# EAGLE design buffered-mult-pcb-a (EAGLE 7.2.0)
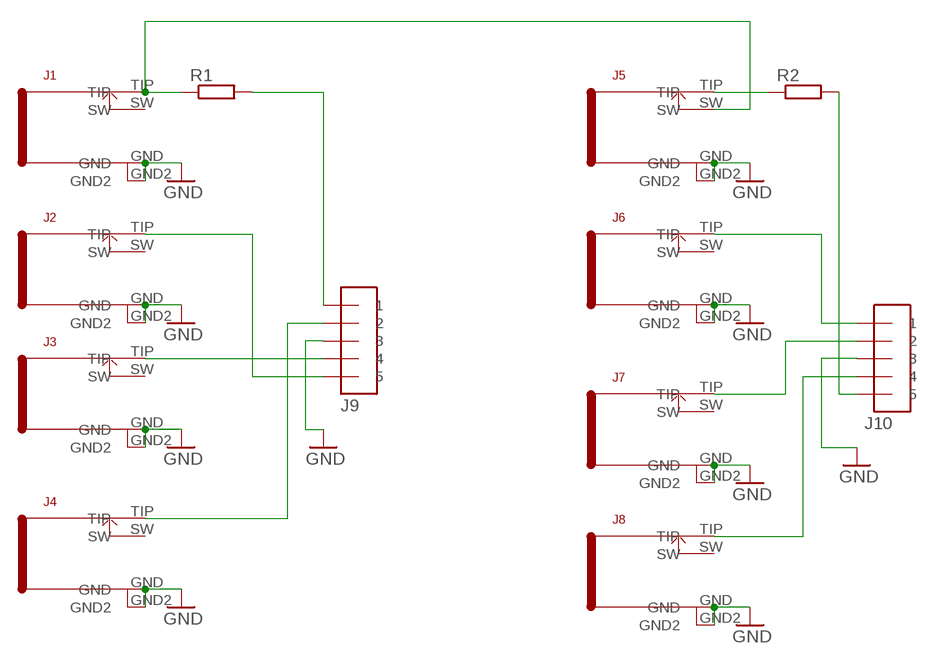
[diagram p0: schematic, sheet 1]

## Parts
J1  WQP_PJ_301BM  [WQP_PJ_301BM]
J2  WQP_PJ_301BM  [WQP_PJ_301BM]
J3  WQP_PJ_301BM  [WQP_PJ_301BM]
J4  WQP_PJ_301BM  [WQP_PJ_301BM]
J5  WQP_PJ_301BM  [WQP_PJ_301BM]
J6  WQP_PJ_301BM  [WQP_PJ_301BM]
J7  WQP_PJ_301BM  [WQP_PJ_301BM]
J8  WQP_PJ_301BM  [WQP_PJ_301BM]
J9  5X1_2_54_HEADER  [5X1_2_54_HEADER]
J10  5X1_2_54_HEADER  [5X1_2_54_HEADER]
R1  R-EU_R0603  [R0603]
R2  R-EU_R0603  [R0603]

## Nets
GND: J1.GND J1.GND2 J2.GND J2.GND2 J3.GND J3.GND2 J4.GND J4.GND2 J5.GND J5.GND2 J6.GND J6.GND2 J7.GND J7.GND2 J8.GND J8.GND2 J9.3 J10.3
N$1: J2.TIP J9.5
N$2: J3.TIP J9.4
N$3: J4.TIP J9.2
N$4: J10.5 R2.2
N$5: J7.TIP J10.2
N$6: J8.TIP J10.4
N$7: J6.TIP J10.1
N$9: J1.TIP J5.SW R1.1
N$10: J9.1 R1.2
N$11: J5.TIP R2.1
Unconnected: J1.SW J2.SW J3.SW J4.SW J6.SW J7.SW J8.SW

## Library data of the parts
J1-J8 = mjb-parts:WQP_PJ_301BM
J9 J10 = mjb-parts:5X1_2_54_HEADER
R1 R2 = rcl:R-EU_: RESISTOR, European symbol

## Board
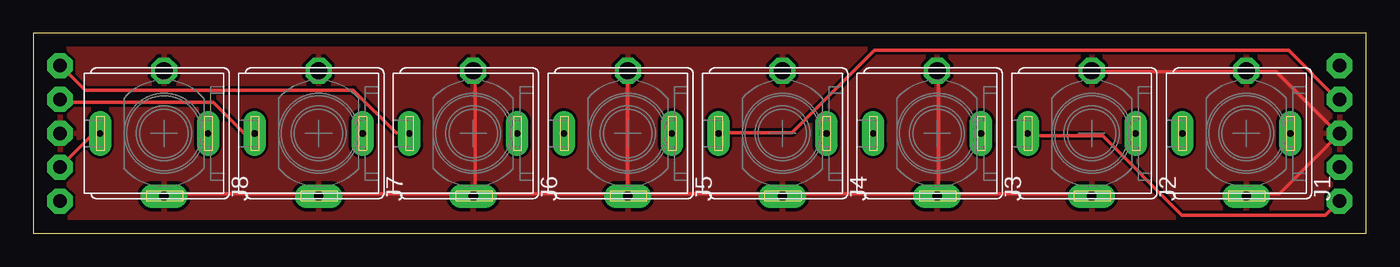
[diagram p1: board, top side]
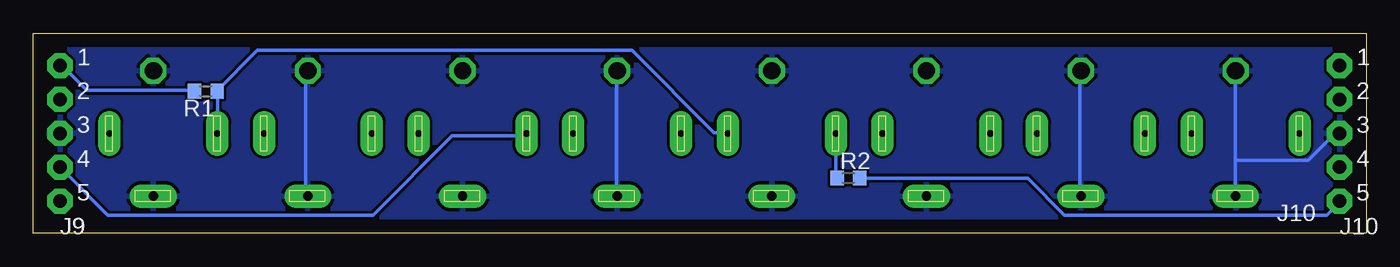
[diagram p2: board, bottom side, seen from below]

Size 100 x 15 mm. Coordinates in mm from the lower left corner, seen from the top.
Outline: 0,0 100,0 100,15 0,15 0,0
Copper layers (1*16): Top 0.035mm / dielectric 1.5mm / Bottom 0.035mm
Design rules "default": minimum track width 10mil, minimum drill 24mil, track to track 8mil, track to pad 8mil, pad to pad 8mil, via to via 8mil, smd to smd 8mil, copper to edge 40mil, drill to drill 8mil, minimum pad ring 10mil, minimum via ring 8mil, stop-mask expansion 4mil, vias tented up to drill 0mil, thermal gap 10mil

### Footprints (pad centres in the part's own frame; a part is rotated, then mirrored left to right if it is on the bottom)
WQP_PJ_301BM = drill 0.7 pad 1.778 long: GND -4.7,0 | drill 1.3 octagon: GND2 4.7,0 | drill 0.5 pad 1.676 long: SW 0,-3.3; TIP 0,4.8
5X1_2_54_HEADER = drill 1.016 pad 1.88 octagon: 1 0,5.08; 2 0,2.54; 3 0,0; 4 0,-2.54; 5 0,-5.08
R0603 = smd 1 x 1.1: 1 -0.85,0; 2 0.85,0

### Placement (x,y rotation side)
J1  91,7.5 90 top
J2  79.4,7.5 90 top
J3  67.8,7.5 90 top
J4  56.2,7.5 90 top
J5  44.6,7.5 90 top
J6  33,7.5 90 top
J7  21.4,7.5 90 top
J8  9.8,7.5 90 top
J9  98,7.5 0 bottom
J10  2,7.5 0 bottom
R1  87.06,10.65 180 bottom
R2  38.85,4.15 0 bottom

### Tracks (layer width: path | path; a pad name or v marks a point on that pad's centre or on a via)
GND
  Top 0.254: J1.GND 91.21,2.97 93.5,2.97 97.84,7.32 J9.3 97.84,7.54 93.27,12.12 91.21,12.12 J1.GND2 90.98,12.12 79.55,12.12 J2.GND2 | 67.89,2.97 67.89,12.12 J3.GND2 | 67.89,2.97 79.32,2.97 J2.GND | 67.89,2.97 J3.GND 67.67,2.97 56.24,2.97 J4.GND 56.01,2.97 44.81,2.97 J5.GND 44.58,2.97 | 44.58,2.97 44.58,12.12 J5.GND2 | 33.15,2.97 33.15,12.12 J6.GND2 | J8.GND 9.83,2.97 21.26,2.97 J7.GND 21.49,2.97 32.92,2.97 J6.GND 33.15,2.97 | 33.15,2.97 44.58,2.97
  Bottom 0.254: J2.GND 79.55,2.97 79.55,12.12 J2.GND2 | J4.GND 56.24,2.97 56.24,12.12 J4.GND2 | 9.83,5.49 9.83,12.12 J8.GND2 | 9.83,5.49 9.83,2.97 J8.GND | 9.83,5.49 4.34,5.49 2.52,7.32 2.06,7.32 J10.3 | J7.GND 21.49,2.97 21.49,12.12 J7.GND2
  pour Bottom: 0,0 0,15 99.9,15 100,15.1 100,-0.1 100.1,-0.2 0.1,-0.2 0,-0.1
  pour Top: 0,0 0,15 100,15 100.1,14.9 100.1,0.2 99.9,0 0,0
N$1
  Top 0.254: J2.TIP 74.75,7.32 80.24,7.32 86.18,1.37 96.93,1.37 97.84,2.29 J9.5
N$2
  Bottom 0.254: J3.TIP 63.09,7.32 68.58,7.32 74.52,1.37 94.41,1.37 97.84,4.8 J9.4
N$3
  Top 0.254: J4.TIP 51.44,7.54 56.92,7.54 63.09,13.72 94.18,13.72 97.84,10.06 J9.2
N$4
  Bottom 0.254: R2.2 37.95,4.12 25.38,4.12 22.63,1.37 2.97,1.37 2.06,2.29 J10.5
N$5
  Top 0.254: J7.TIP 16.46,7.54 15.77,7.54 13.49,9.83 2.06,9.83 J10.2
N$6
  Top 0.254: J8.TIP 4.8,7.32 4.34,7.32 2.06,5.03 J10.4
N$7
  Top 0.254: J6.TIP 28.12,7.54 27.2,7.54 24,10.74 3.89,10.74 2.06,12.57 J10.1
N$9
  Bottom 0.254: J1.TIP 86.18,7.54 86.18,10.52 R1.1 86.18,10.74 83.21,13.72 55.09,13.72 48.92,7.54 48.01,7.54 J5.SW
N$10
  Bottom 0.254: R1.2 88.01,10.74 96.01,10.74 97.84,12.57 J9.1
N$11
  Bottom 0.254: R2.1 39.78,4.34 39.78,7.32 J5.TIP